# Altium schematic sheet MSP430FR5739.SchDoc: Transiently Powered Computers
size Letter; Author: Hrishikesh Jayakumar; DrawnBy: 2; Engineer: Hrishikesh; Organization: Embedded Systems Lab; Address1: 465 Northwestern Avenue; Address2: ECE Dept; Address3: Purdue University; Address4: West Lafayette, IN 47907; DocumentNumber: 4; Revision: B; SheetNumber: 4; SheetTotal: 6; DocumentName: ISHIDDEN=T
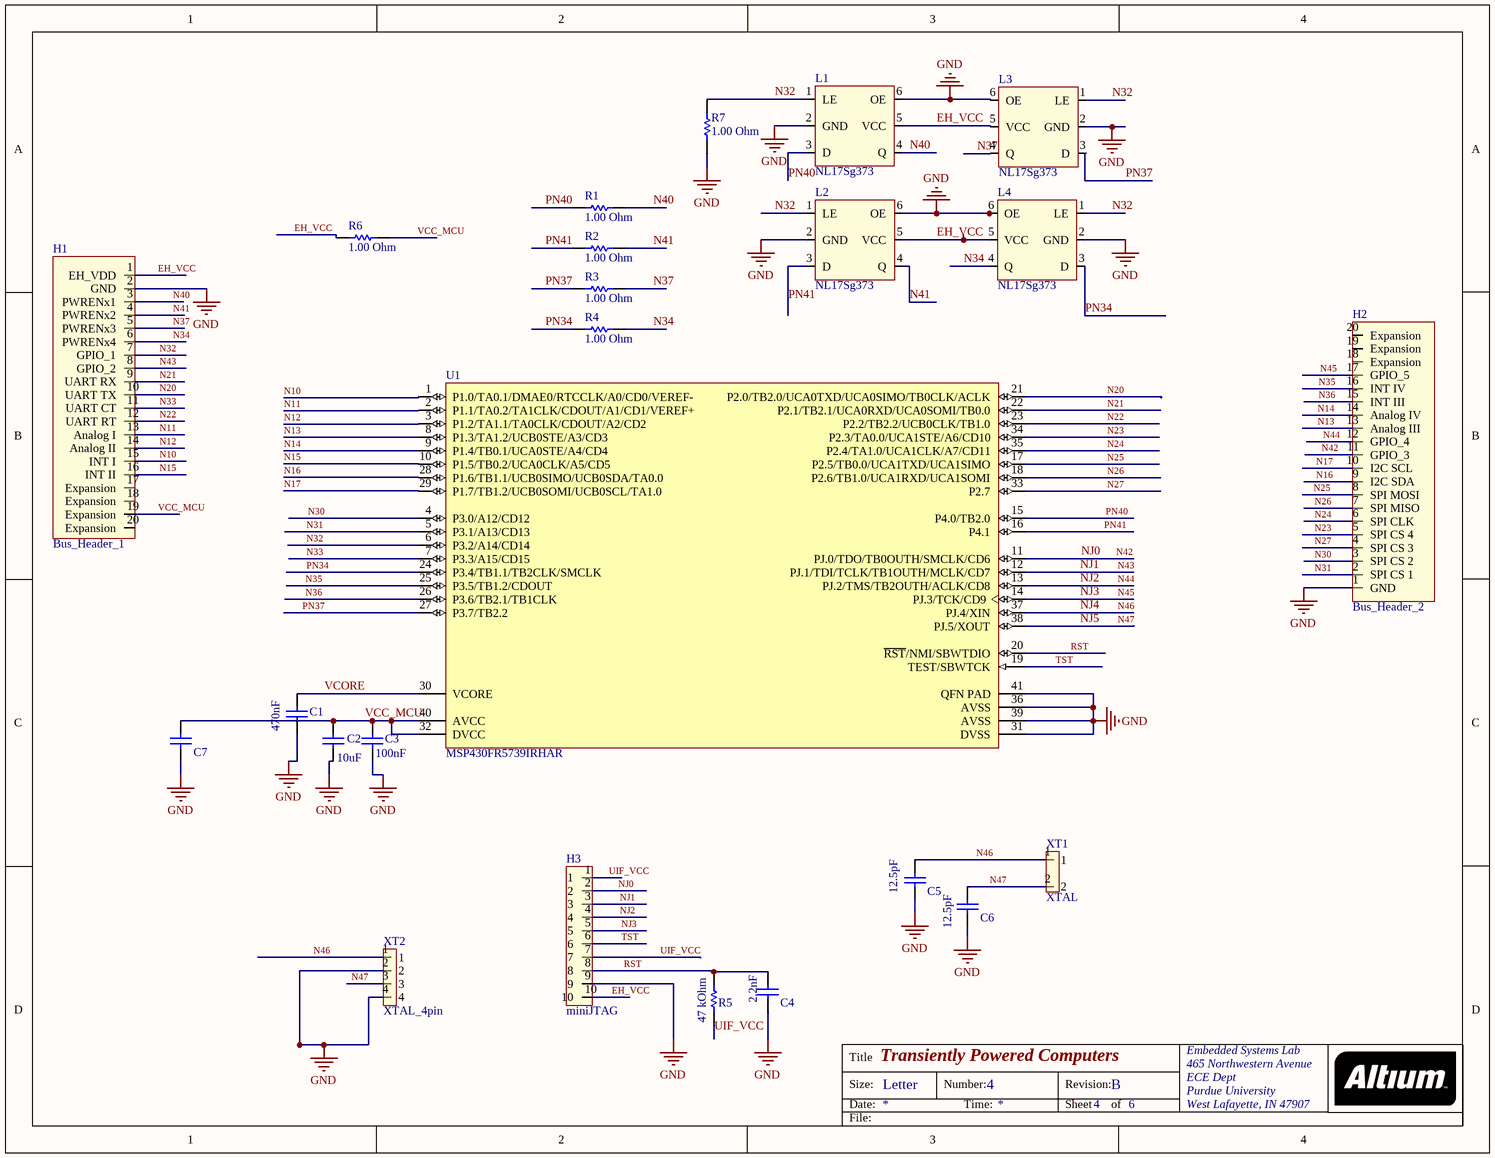
[diagram p0: MSP430FR5739.SchDoc]

## Parts
C1  value 470nF  [CAPC0201(0603)33_N]  (hidden comment: CAP 220nF 4V 0201(0603))
C2  value 10uF  [CAPC0402(1005)70_N]  (hidden comment: CAP 4.7uF 4V 0402(1005))
C3  value 100nF  [CAPC0201(0603)33_M]  (hidden comment: CAP 100nF 4V 0201(0603))
C4  value 2.2nF  [CAPC0402(1005)60_M]  (hidden comment: CAP 2.2uF 4V 0402(1005))
C5  value 12.5pF  [CAPC0402(1005)60_N]  (hidden comment: CAP 470nF 4V 0402(1005))
C6  value 12.5pF  [CAPC0402(1005)60_N]  (hidden comment: CAP 470nF 4V 0402(1005))
C7  CAP 0.5pF 10V 0805(2012)  [CAPC0805(2012)75_L]  (value not drawn)
H1  Bus_Header_1  [Male Single row 20 pin header]
H2  Bus_Header_2  [Male Single row 20 pin header]
H3  miniJTAG  [SMT10pin_micro]
L1  NL17Sg373  [SOT65P210X110-6N]
L2  NL17Sg373  [SOT65P210X110-6N]
L3  NL17Sg373  [SOT65P210X110-6N]
L4  NL17Sg373  [SOT65P210X110-6N]
R1  value 1.00 Ohm  [RESC0402(1005)_N]  (hidden comment: 1R 5% 0402(1005))
R2  value 1.00 Ohm  [RESC0402(1005)_N]  (hidden comment: 1R 5% 0402(1005))
R3  value 1.00 Ohm  [RESC0402(1005)_N]  (hidden comment: 1R 5% 0402(1005))
R4  value 1.00 Ohm  [RESC0402(1005)_N]  (hidden comment: 1R 5% 0402(1005))
R5  value 47 kOhm  [RESC0402(1005)_M]  (hidden comment: 47K 5% 0402(1005))
R6  value 1.00 Ohm  [RESC0402(1005)_N]  (hidden comment: 1R 5% 0402(1005))
R7  value 1.00 Ohm  [RESC0402(1005)_N]  (hidden comment: 1R 5% 0402(1005))
U1  MSP430FR5739IRHAR  [Via_modified_TI-RHA40-2900X2900TP_N]
XT1  XTAL  [Crystal_32]
XT2  XTAL_4pin  [CRYSTAL_MHZ]

## Nets
GND: C1.1 C2.1 C3.1 C4.1 C5.1 C6.1 C7.1 H1.2(GND) H2.1(GND) H3.9 L1.2(GND) L1.6(OE) L2.2(GND) L2.6(OE) L3.2(GND) L3.6(OE) L4.2(GND) L4.6(OE) R7.2 U1.31(DVSS) U1.36(AVSS) U1.39(AVSS) U1.41(QFN_PAD) XT2.2 XT2.4
EH_VCC: H1.1(EH_VDD) H3.10 L1.5(VCC) L2.5(VCC) L3.5(VCC) L4.5(VCC) R6.2
N10: H1.15(INT_I) U1.1(P1.0/TA0.1/DMAE0/RTCCLK/A0/CD0/VEREF-)
N11: H1.13(Analog_I) U1.2(P1.1/TA0.2/TA1CLK/CDOUT/A1/CD1/VEREF+)
N12: H1.14(Analog_II) U1.3(P1.2/TA1.1/TA0CLK/CDOUT/A2/CD2)
N13: H2.13(Analog_III) U1.8(P1.3/TA1.2/UCB0STE/A3/CD3)
N14: H2.14(Analog_IV) U1.9(P1.4/TB0.1/UCA0STE/A4/CD4)
N15: H1.16(INT_II) U1.10(P1.5/TB0.2/UCA0CLK/A5/CD5)
N16: H2.9(I2C_SDA) U1.28(P1.6/TB1.1/UCB0SIMO/UCB0SDA/TA0.0)
N17: H2.10(I2C_SCL) U1.29(P1.7/TB1.2/UCB0SOMI/UCB0SCL/TA1.0)
N20: H1.10(UART_TX) U1.21(P2.0/TB2.0/UCA0TXD/UCA0SIMO/TB0CLK/ACLK)
N21: H1.9(UART_RX) U1.22(P2.1/TB2.1/UCA0RXD/UCA0SOMI/TB0.0)
N22: H1.12(UART_RT) U1.23(P2.2/TB2.2/UCB0CLK/TB1.0)
N23: H2.5(SPI_CS_4) U1.34(P2.3/TA0.0/UCA1STE/A6/CD10)
N24: H2.6(SPI_CLK) U1.35(P2.4/TA1.0/UCA1CLK/A7/CD11)
N25: H2.8(SPI_MOSI) U1.17(P2.5/TB0.0/UCA1TXD/UCA1SIMO)
N26: H2.7(SPI_MISO) U1.18(P2.6/TB1.0/UCA1RXD/UCA1SOMI)
N27: H2.4(SPI_CS_3) U1.33(P2.7)
N30: H2.3(SPI_CS_2) U1.4(P3.0/A12/CD12)
N31: H2.2(SPI_CS_1) U1.5(P3.1/A13/CD13)
N32: H1.7(GPIO_1) L1.1(LE) L2.1(LE) L3.1(LE) L4.1(LE) R7.1 U1.6(P3.2/A14/CD14)
N33: H1.11(UART_CT) U1.7(P3.3/A15/CD15)
N34: H1.6(PWRENx4) L4.4(Q) R4.1
N35: H2.16(INT_IV) U1.25(P3.5/TB1.2/CDOUT)
N36: H2.15(INT_III) U1.26(P3.6/TB2.1/TB1CLK)
N37: H1.5(PWRENx3) L3.4(Q) R3.1
N40: H1.3(PWRENx1) L1.4(Q) R1.1
N41: H1.4(PWRENx2) L2.4(Q) R2.1
N42: H2.11(GPIO_3) H3.2 U1.11(PJ.0/TDO/TB0OUTH/SMCLK/CD6)  [also labelled NJ0]
N43: H1.8(GPIO_2) H3.3 U1.12(PJ.1/TDI/TCLK/TB1OUTH/MCLK/CD7)  [also labelled NJ1]
N44: H2.12(GPIO_4) H3.4 U1.13(PJ.2/TMS/TB2OUTH/ACLK/CD8)  [also labelled NJ2]
N45: H2.17(GPIO_5) H3.5 U1.14(PJ.3/TCK/CD9)  [also labelled NJ3]
N46: C5.2 U1.37(PJ.4/XIN) XT1.1 XT2.1  [also labelled NJ4]
N47: C6.2 U1.38(PJ.5/XOUT) XT1.2 XT2.3  [also labelled NJ5]
PN34: L4.3(D) R4.2 U1.24(P3.4/TB1.1/TB2CLK/SMCLK)
PN37: L3.3(D) R3.2 U1.27(P3.7/TB2.2)
PN40: L1.3(D) R1.2 U1.15(P4.0/TB2.0)
PN41: L2.3(D) R2.2 U1.16(P4.1)
RST: C4.2 H3.8 R5.2 U1.20(~{RST}/NMI/SBWTDIO)
TST: H3.6 U1.19(TEST/SBWTCK)
UIF_VCC: H3.1 H3.7 R5.1
VCC_MCU: C2.2 C3.2 C7.2 H1.19(Expansion) R6.1 U1.32(DVCC) U1.40(AVCC)
VCORE: C1.2 U1.30(VCORE)

Not connected (* = marked no-connect by the designer): H1 17(Expansion) 18(Expansion) 20(Expansion); H2 18(Expansion) 19(Expansion) 20(Expansion)

## Notes on the sheet
- Title
- Size:
- Date:
- Letter
- Number:
- Time:
- Revision:
- Sheet
- of
- File:

## Library data of the parts
C1 = CMP-1033-00669-1: CAP 220nF 4V ±20% 0201 (0603 Metric) Thickness 0.33mm SMD; Case-EIA: 0201; Case-Metric: 0603; Rated Voltage: 4 V; Technology: SMT; Tolerance: ±20%; Max Thickness: 0.33 mm
C2 = CMP-1034-02135-1: CAP 10uF 4V ±20% 0402 (1005 Metric) Thickness 0.7mm SMD; Case-Metric: 1005; Case-EIA: 0402; Tolerance: ±20%; Max Thickness: 0.7 mm; Rated Voltage: 4 V; Technology: SMT
C3 = CMP-1033-00657-1: CAP 100nF 4V ±10% 0201 (0603 Metric) Thickness 0.33mm SMD; Case-EIA: 0201; Case-Metric: 0603; Technology: SMT; Max Thickness: 0.33 mm; Tolerance: ±10%; Rated Voltage: 4 V
C4 = CMP-1034-02124-1: CAP 2.2uF 4V ±20% 0402 (1005 Metric) Thickness 0.6mm SMD; Case-Metric: 1005; Case-EIA: 0402; Tolerance: ±20%; Rated Voltage: 4 V; Technology: SMT; Max Thickness: 0.6 mm
C5 C6 = CMP-1034-02101-1: CAP 470nF 4V ±10% 0402 (1005 Metric) Thickness 0.6mm SMD; Case-EIA: 0402; Case-Metric: 1005; Tolerance: ±10%; Technology: SMT; Rated Voltage: 4 V; Max Thickness: 0.6 mm
C7 = CMP-1036-00001-1: CAP 0.5pF 10V ±0.1pF 0805 (2012 Metric) Thickness 0.75mm SMD; Case-Metric: 2012; Case-EIA: 0805; Tolerance: ±0.1pF; Max Thickness: 0.75 mm; Technology: SMT; Rated Voltage: 10 V; Value: 0.5pF
R1-R4 R6 R7 = CMP-1011-00002-1: 1R 0.063W 5% 0402 (1005 Metric)  SMD; Case-Metric: 1005; Case-EIA: 0402; Power: 0.063 W; Technology: SMT; Tolerance: 5 %
R5 = CMP-1011-00114-1: 47K 0.063W 5% 0402 (1005 Metric)  SMD; Case-EIA: 0402; Case-Metric: 1005; Tolerance: 5 %; Technology: SMT; Power: 0.063 W
U1 = CMP-0365-01094-1: 24 MHz Mixed Signal Microcontroller, 1024 B SRAM and 33 GPIOs, -40 to 85 degC, 40-pin QFN (RHA), Green (RoHS & no Sb/Br); Manufacturer: Texas Instruments; SVS: Yes; ADC Channels: 14; SubFamily: FRAM Series; ADC: 10-bit SAR; Timers - 16-bit: 5; SRAM(B): 1024; USCI_A (UART/LIN/IrDA/SPI): 2; GPIO: 33; USCI_B (I2C & SPI): 1; Frequency(MHz): 24; DMA: 3; FRAM(KB): 16; Multiplier: 32x32; Eco-Plan: Green (RoHS & no Sb/Br); ComponentLink3URL: http://www.ti.com/litv/pdf/mtss003d; ComponentLink3Description: Package Specification; ComponentLink1Description: Manufacturer URL; DatasheetVersion: SLAS639D; Code_JEDEC: MO-153; PackageReference: RHA40-2900X2900TP; Watchdog: Yes; PartNumber: MSP430FR5739IRHAR; PackageDescription: 40-Pin Plastic Flat Pack, Body 6 x 6 mm, Pitch 0.5 mm; ComponentLink1URL: http://www.ti.com/; ComponentLink2Description: Datasheet; Brown Out Reset: Yes; Comparators: Yes; Real-Time Clock: Yes; ComponentLink2URL: http://www.ti.com/general/docs/lit/getliterature.tsp?genericPartNumber=MSP430FR5739&fileType=pdf; Mounting Technology: Surface Mount